# EAGLE design DuoRS-485Shield (EAGLE 8.0.2)
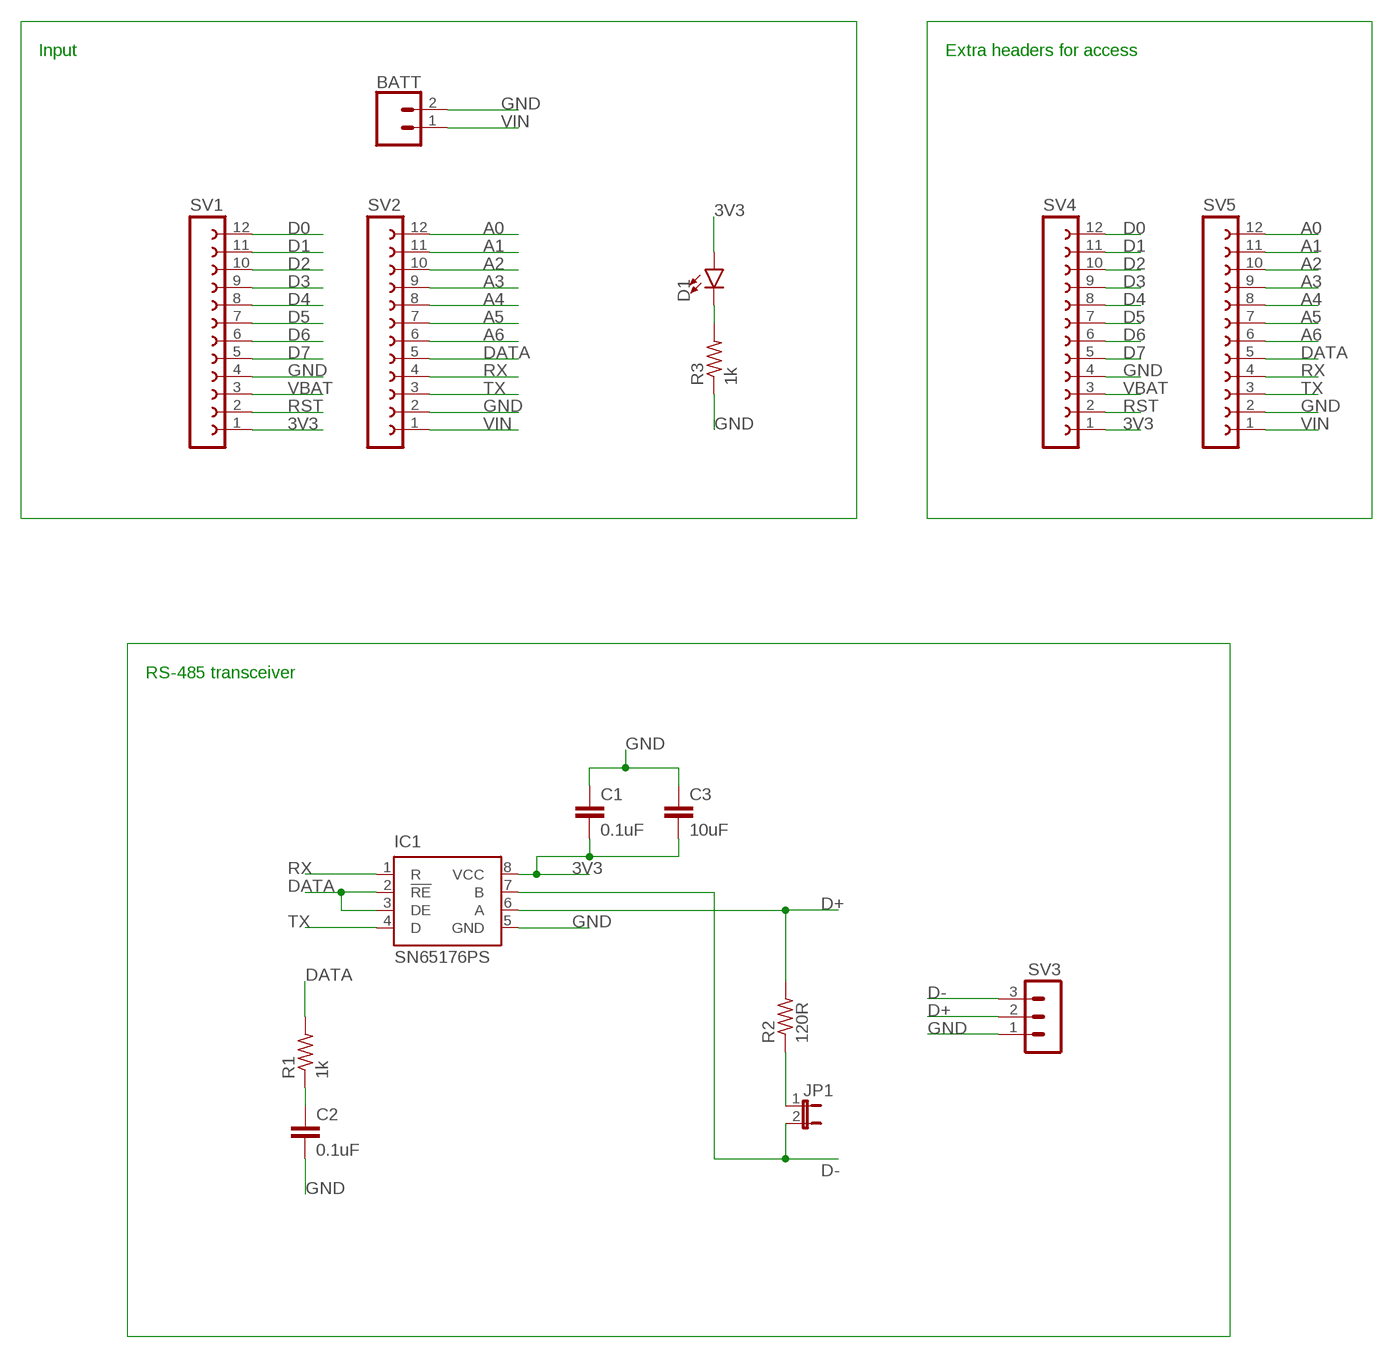
[diagram p0: schematic, sheet 1]

## Parts
BATT  CONN_02JST-PTH-2  [JST-2-PTH]
C1  0.1uF  0.1UF-0603-25V-5%  [0603]
C2  0.1uF  0.1UF-0603-25V-5%  [0603]
C3  10uF  10UF-0603-6.3V-20%  [0603]
D1  LED-3MM-NO_SILK  [LED_3MM-NS]
IC1  SN65176PS  [SOP-08]
JP1  JP1E  [JP1]
R1  1k  R-US_R0805  [R0805]
R2  120R  R-US_R0805  [R0805]
R3  1k  R-US_R0805  [R0805]
SV1  FE12-1  [FE12]
SV2  FE12-1  [FE12]
SV3  MA03-1  [MA03-1]
SV4  FE12-1  [FE12]
SV5  FE12-1  [FE12]

## Nets
3V3: C1.2 C3.2 D1.A IC1.8(VCC) SV1.1 SV4.1
A0: SV2.12 SV5.12
A1: SV2.11 SV5.11
A2: SV2.10 SV5.10
A3: SV2.9 SV5.9
A4: SV2.8 SV5.8
A5: SV2.7 SV5.7
A6: SV2.6 SV5.6
D0: SV1.12 SV4.12
D1: SV1.11 SV4.11
D2: SV1.10 SV4.10
D3: SV1.9 SV4.9
D4: SV1.8 SV4.8
D5: SV1.7 SV4.7
D6: SV1.6 SV4.6
D7: SV1.5 SV4.5
D+: IC1.6(A) R2.2 SV3.2
D-: IC1.7(B) JP1.2 SV3.3
DATA: IC1.2(!RE) IC1.3(DE) R1.2 SV2.5 SV5.5
GND: BATT.2 C1.1 C2.2 C3.1 IC1.5(GND) R3.1 SV1.4 SV2.2 SV3.1 SV4.4 SV5.2
N$2: C2.1 R1.1
N$3: D1.K(C) R3.2
N$4: JP1.1 R2.1
RST: SV1.2 SV4.2
RX: IC1.1(R) SV2.4 SV5.4
TX: IC1.4(D) SV2.3 SV5.3
VBAT: SV1.3 SV4.3
VIN: BATT.1 SV2.1 SV5.1

## Notes on the sheet
- Input | Extra headers for access
- RS-485 transceiver

## Library data of the parts
BATT = SparkFun-Connectors:CONN_02: Multi connection point. Often used as Generic Header-pin footprint for 0.1 inch spaced/style header connections On any of the 0.1 inch spaced packages, you can populate with these: Break Away Headers - Straight <https://www.sparkfun.com/products/116> (PRT-00116) Break Away Male Headers - Right Angle <https://www.sparkfun.com/products/553> (PRT-00553) Female Headers <https://www.sparkfun.com/products/115> (PRT-00115) Break Away Headers - Machine Pin <https://www.sparkfun.com/products/117> (PRT-00117) Break Away Female Headers - Swiss Machine Pin <https://www.sparkfun.com/products/743> (PRT-00743) For SCREWTERMINALS and SPRING TERMINALS visit here: Screw Terimnals on SparkFun.com <https://www.sparkfun.com/search/results?term=Screw+Terminals> (5mm/3.5mm/2.54mm spacing) This device is also useful as a general connection point to wire up your design to another part of your project. Our various solder wires solder well into these plated through hole pads. Hook-Up Wire - Assortment (Stranded, 22 AWG) <https://www.sparkfun.com/products/11375> (PRT-11375) Hook-Up Wire - Assortment (Solid Core, 22 AWG) <https://www.sparkfun.com/products/11367> (PRT-11367) View the entire wire category on our website here <https://www.sparkfun.com/categories/141> Special notes: Molex polarized connector foot print use with: PRT-08233 with associated crimp pins and housings. 2.54_SCREWTERM for use with PRT-10571. 3.5mm Screw Terminal footprints for PRT-08084 5mm Screw Terminal footprints for use with PRT-08432; PROD_ID: CONN-09863; SKU: PRT-09914
C1 C2 = SparkFun-Capacitors:0.1UF: 0.1µF ceramic capacitors A capacitor is a passive two-terminal electrical component used to store electrical energy temporarily in an electric field.; PROD_ID: CAP-08604
C3 = SparkFun-Capacitors:10UF: 10.0µF ceramic capacitors A capacitor is a passive two-terminal electrical component used to store electrical energy temporarily in an electric field.; PROD_ID: CAP-11015
D1 = SparkFun-LED:LED: LED (Generic) Standard schematic elements and footprints for 5mm, 3mm, 1206, and 0603 sized LEDs. Generic LEDs with no color specified.
IC1 = texas:SN65176: DIFFERENTIAL BUS TRANSCEIVER Source: http://focus.ti.com .. sn65176b.pdf; OC_FARNELL: unknown; OC_NEWARK: unknown
JP1 = jumper:JP1E: JUMPER
R1-R3 = resistor:R-US_: RESISTOR, American symbol
SV1 SV2 SV4 SV5 = con-lsta:FE12-1: FEMALE HEADER; OC_FARNELL: unknown; OC_NEWARK: unknown
SV3 = con-lstb:MA03-1: PIN HEADER; OC_FARNELL: unknown; OC_NEWARK: unknown

## Net classes
0 default: drill 0.8 mm

## Board
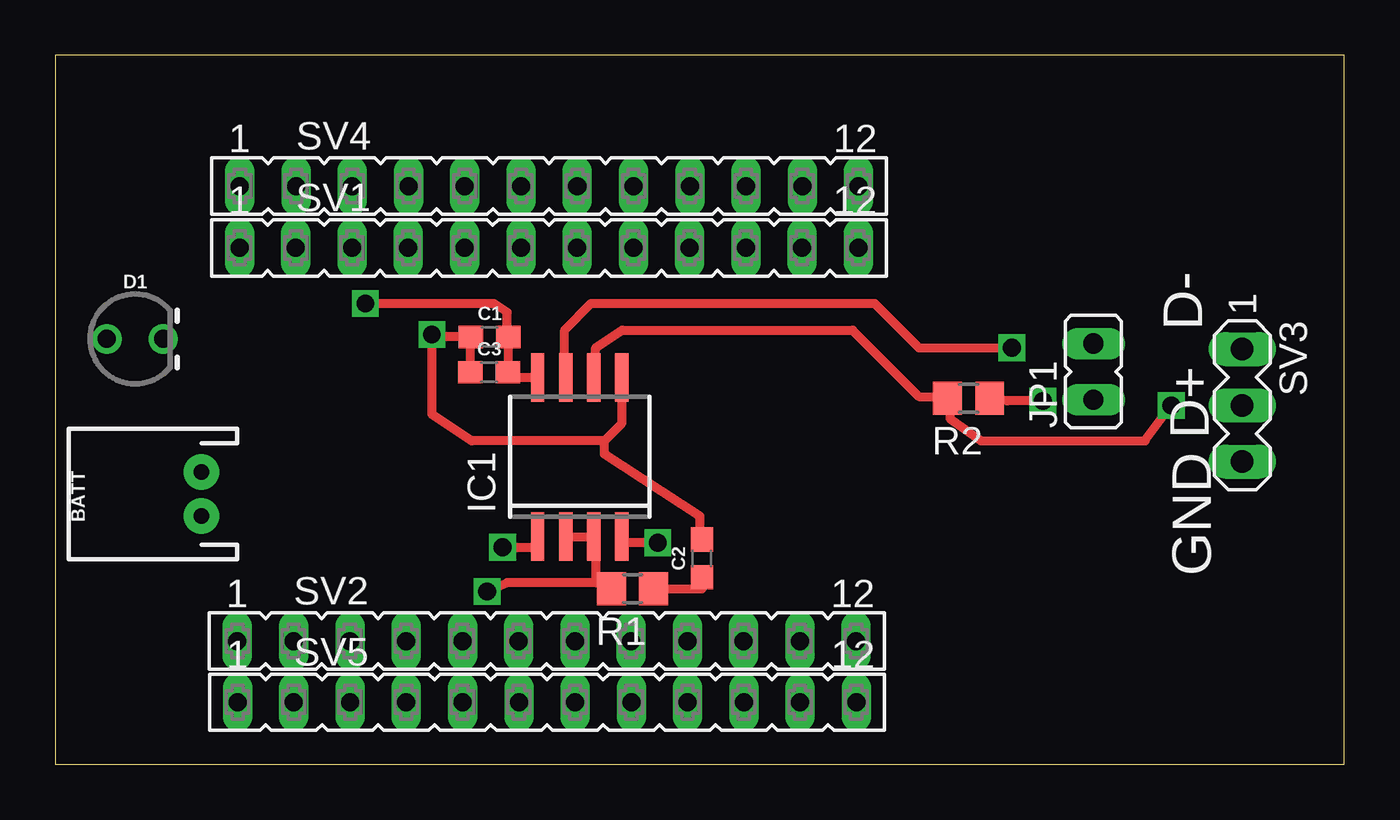
[diagram p1: board, top side]
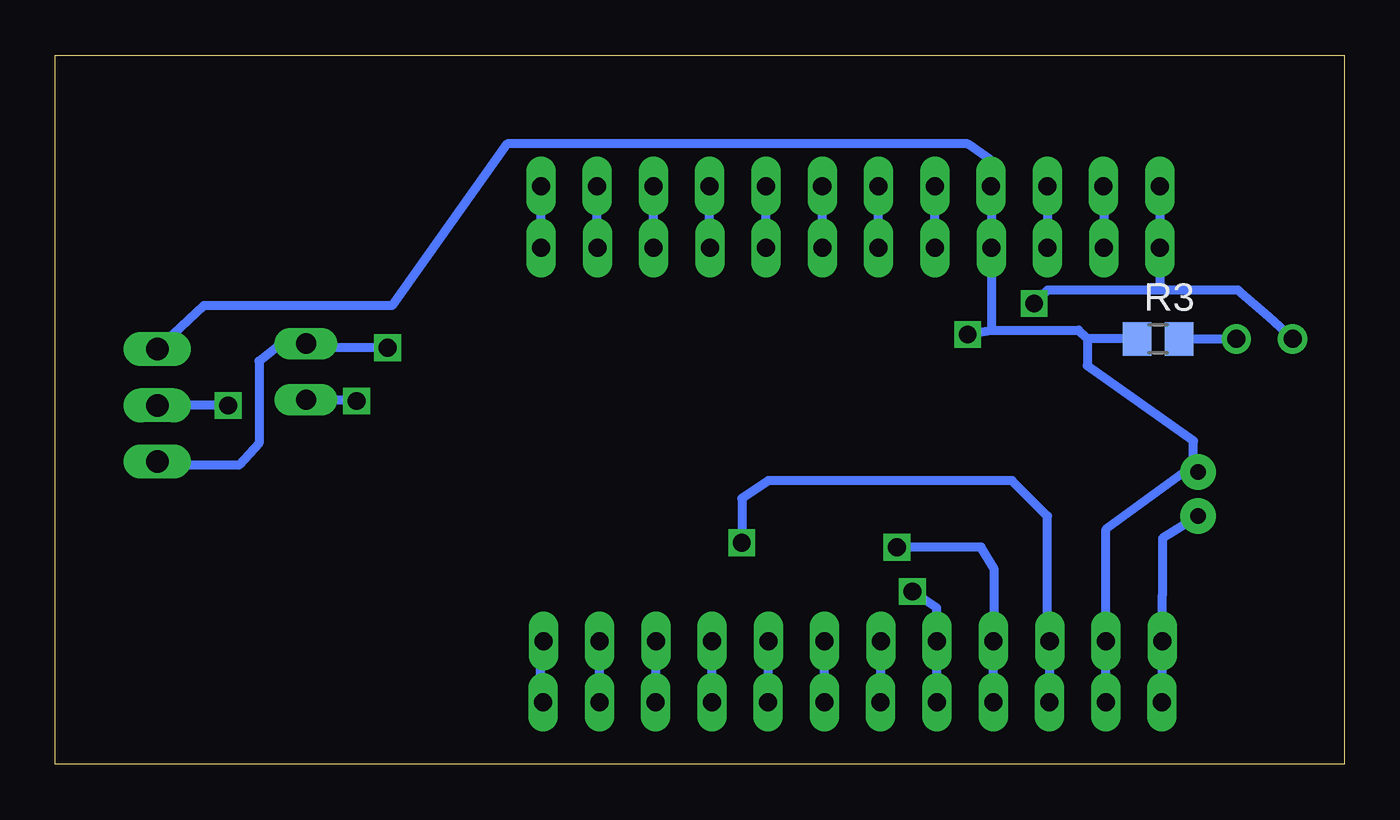
[diagram p2: board, bottom side, seen from below]

Size 58.2 x 32 mm. Coordinates in mm from the lower left corner, seen from the top.
Outline: 0,0 58.2,0 58.2,32 0,32 0,0
Copper layers (1*16): Top 0.035mm / dielectric 1.5mm / Bottom 0.035mm
Design rules "default *": minimum track width 10mil, minimum drill 0.8mm, track to track 8mil, track to pad 8mil, pad to pad 8mil, via to via 8mil, smd to smd 8mil, copper to edge 40mil, drill to drill 10mil, minimum pad ring 10mil, minimum via ring 8mil, stop-mask expansion 4mil, vias tented up to drill 0mil, thermal gap 10mil

### Footprints (pad centres in the part's own frame; a part is rotated, then mirrored left to right if it is on the bottom)
JST-2-PTH = drill 0.7 pad 1.6: 1 -1,0; 2 1,0
0603 = smd 1.1 x 1: 1 -0.85,0; 2 0.85,0
LED_3MM-NS = drill 0.813: A -1.27,0; K 1.27,0
SOP-08 = smd 0.6 x 2.2: 1 -1.905,-3.6; 2 -0.635,-3.6; 3 0.635,-3.6; 4 1.905,-3.6; 5 1.905,3.575; 6 0.635,3.575; 7 -0.635,3.575; 8 -1.905,3.575
JP1 = drill 0.914 long: 1 0,-1.27; 2 0,1.27
R0805 = smd 1.3 x 1.5: 1 -0.95,0; 2 0.95,0
FE12 = drill 0.813 long: 1 -13.97,0; 2 -11.43,0; 3 -8.89,0; 4 -6.35,0; 5 -3.81,0; 6 -1.27,0; 7 1.27,0; 8 3.81,0; 9 6.35,0; 10 8.89,0; 11 11.43,0; 12 13.97,0
MA03-1 = drill 1.016 long: 1 -2.54,0; 2 0,0; 3 2.54,0

### Placement (x,y rotation side)
BATT  6.6,12.2 90 top
C1  19.61,19.29 0 top
C2  29.2,9.29 90 top
C3  19.59,17.69 0 top
D1  3.6,19.2 0 top
IC1  23.68,13.88 0 top
JP1  46.88,17.72 0 top
R1  26.06,7.92 180 top
R2  41.24,16.52 180 top
R3  8.4,19.2 0 bottom
SV1  22.29,23.31 0 top
SV2  22.19,5.56 0 top
SV3  53.6,16.2 270 top
SV4  22.3,26.1 0 top
SV5  22.2,2.8 0 top

### Tracks (layer width: path | path; a pad name or v marks a point on that pad's centre or on a via)
3V3  (via drill 0.8)
  Top 0.406: IC1.8 20.44,17.46 C3.2 20.46,17.69 C1.2 20.4,19.29 20.4,20.4 19.8,20.8 v14,20.8
  Bottom 0.406: D1.A 3.4,20.2 4.8,21.4 8.32,21.4 | 8.32,21.4 SV1.1 SV4.1 | v14,20.8 13.4,21.4 8.32,21.4
A0
  Bottom 0.406: SV5.12 36.3,2.8 36.3,4.8 36.16,4.8 SV2.12
A1
  Bottom 0.406: SV5.11 SV2.11
A2
  Bottom 0.406: SV5.10 SV2.10
A3
  Bottom 0.406: SV5.9 SV2.9
A4
  Bottom 0.406: SV5.8 SV2.8
A5
  Bottom 0.406: SV5.7 SV2.7
A6
  Bottom 0.406: SV5.6 SV2.6
D0
  Bottom 0.406: SV1.12 SV4.12
D1
  Bottom 0.406: SV1.11 SV4.11
D2
  Bottom 0.406: SV1.10 SV4.10
D3
  Bottom 0.406: SV1.9 SV4.9
D4
  Bottom 0.406: SV1.8 SV4.8
D5
  Bottom 0.406: SV1.7 SV4.7
D6
  Bottom 0.406: SV1.6 SV4.6
D7
  Bottom 0.406: SV1.5 SV4.5
D+  (via drill 0.8)
  Top 0.406: IC1.6 24.4,17.46 24.4,18.8 25.6,19.6 36,19.6 39,16.6 40.29,16.6 R2.2 40.4,16.52 40.4,15.6 41.8,14.6 49.2,14.6 v50.4,16.2
  Bottom 0.406: v50.4,16.2 SV3.2
D-  (via drill 0.8)
  Top 0.406: IC1.7 23,17.46 23,19.6 24.2,20.8 37,20.8 39,18.8 v43.2,18.8
  Bottom 0.406: v43.2,18.8 46.88,18.8 JP1.2 48,18.99 49,18.2 49,14.5 49.9,13.5 53.6,13.5 SV3.3
DATA  (via drill 0.8)
  Top 0.406: IC1.2 IC1.3 24.4,10.28 24.4,8.2 | v19.5,7.8 20.4,8.2 24.4,8.2 | 24.4,8.2 25.11,8.2 R1.2
  Bottom 0.406: SV5.5 SV2.5 18.4,7.06 v19.5,7.8
GND  (via drill 0.8)
  Top 0.406: C3.1 18.76,17.69 C1.1 17,19.29 v17,19.4 17,15.8 18.8,14.6 24.8,14.6 | 24.8,14.6 25.59,15.4 IC1.5 | C2.2 29.1,10.14 29.1,11.2 24.8,14 24.8,14.6
  Bottom 0.406: 11.6,19.2 11.6,18 6.8,14.6 6.8,13.2 BATT.2 7.2,13.2 10.76,10.6 SV2.2 SV5.2 | 11.6,19.2 12,19.6 15.94,19.6 | 15.94,19.6 SV1.4 SV4.4 16,27.3 17,28 37.8,28 43,20.7 51.5,20.7 SV3.1 | R3.1 11.6,19.2 | v17,19.4 15.94,19.6
N$2
  Top 0.406: R1.1 29.2,7.92 C2.1
N$3
  Bottom 0.406: R3.2 D1.K
N$4  (via drill 0.8)
  Top 0.406: v44.6,16.4 42.99,16.4 R2.1
  Bottom 0.406: JP1.1 44.6,16.45 v44.6,16.4
RST
  Bottom 0.406: SV4.2 SV1.2
RX  (via drill 0.8)
  Top 0.406: 21.77,10.4 IC1.1 21.77,9.8 v20.2,9.8
  Bottom 0.406: v20.2,9.8 16.4,9.8 15.8,8.8 15.8,6.76 SV2.4 SV5.4
TX  (via drill 0.8)
  Top 0.406: v27.2,10 25.59,10 IC1.4
  Bottom 0.406: v27.2,10 27.2,12 26,12.8 15,12.8 13.4,11.2 13.4,5.76 SV2.3 SV5.3
VBAT
  Bottom 0.406: SV4.3 SV1.3
VIN
  Bottom 0.406: BATT.1 8.2,10.2 8.22,7.6 SV2.1 SV5.1

### Text on the board
_tsilk: D- | D+ | GND